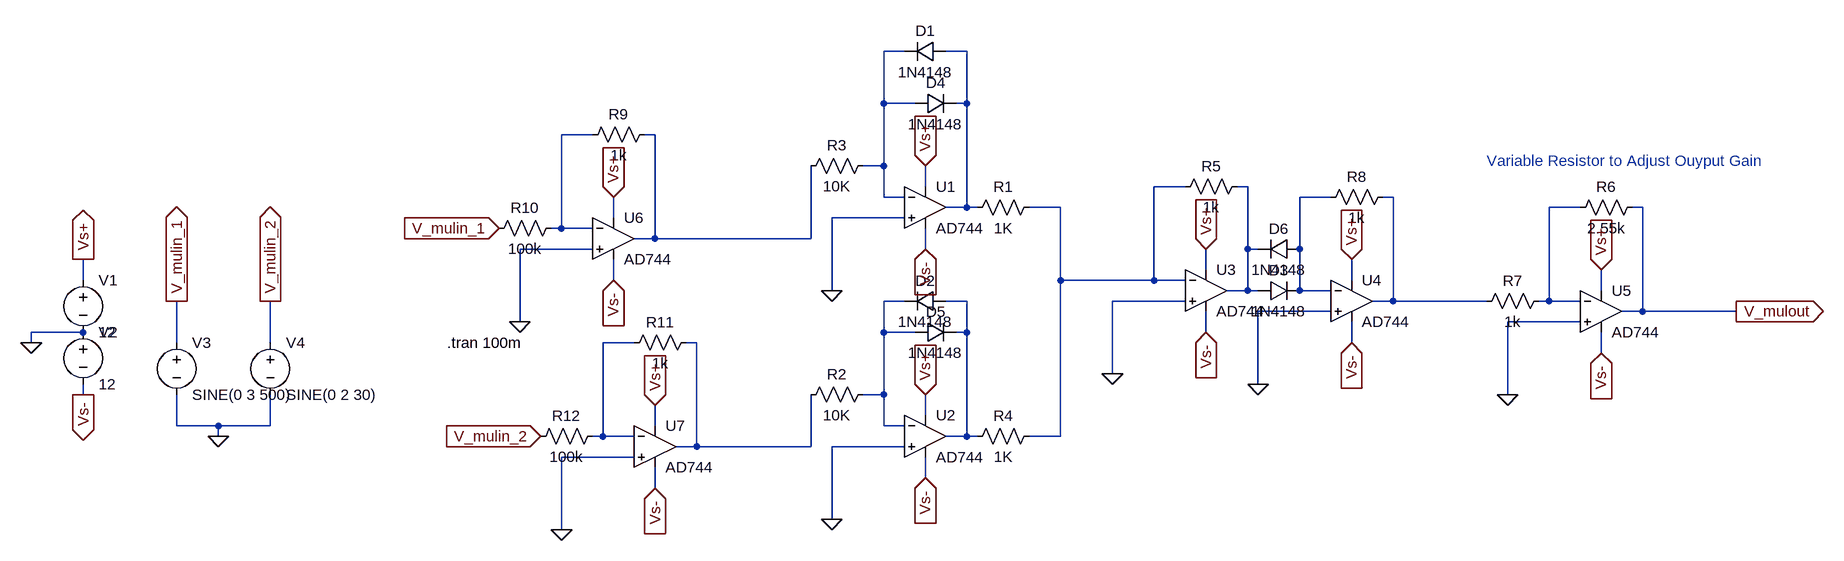
[diagram p0: schematic LogAntilog_Multiplier_FullWave.asc]
LogAntilog_Multiplier_FullWave.asc, the LTspice schematic file:
Version 4.1
SHEET 1 2556 912
WIRE 528 144 496 144
WIRE 624 144 592 144
WIRE 496 224 496 144
WIRE 544 224 496 224
WIRE 624 224 624 144
WIRE 624 224 608 224
WIRE 48 272 0 272
WIRE 144 272 128 272
WIRE 496 320 496 224
WIRE 496 320 464 320
WIRE 560 352 560 320
WIRE 960 352 912 352
WIRE 1056 352 1040 352
WIRE 496 368 496 320
WIRE 528 368 496 368
WIRE 1184 368 1136 368
WIRE 1280 368 1264 368
WIRE 624 384 624 224
WIRE 624 384 592 384
WIRE 640 384 624 384
WIRE 768 384 720 384
WIRE 1568 384 1520 384
WIRE 1664 384 1648 384
WIRE 80 400 80 368
WIRE 528 400 416 400
WIRE 0 416 0 272
WIRE 0 416 -16 416
WIRE 48 416 0 416
WIRE 144 432 144 272
WIRE 144 432 112 432
WIRE 384 432 384 320
WIRE 384 432 144 432
WIRE 48 448 -64 448
WIRE 560 448 560 416
WIRE 1056 448 1056 352
WIRE 1072 448 1056 448
WIRE 1136 448 1136 368
WIRE 992 480 992 448
WIRE -736 496 -736 464
WIRE 80 496 80 464
WIRE 768 496 768 384
WIRE 912 496 912 352
WIRE 912 496 768 496
WIRE 960 496 912 496
WIRE 1216 496 1216 464
WIRE 416 512 416 400
WIRE 1056 512 1056 448
WIRE 1056 512 1024 512
WIRE 1072 512 1056 512
WIRE 1136 512 1136 448
WIRE 1184 512 1136 512
WIRE 1600 512 1600 480
WIRE 528 528 496 528
WIRE 624 528 592 528
WIRE 960 528 848 528
WIRE 1280 528 1280 368
WIRE 1280 528 1248 528
WIRE 1424 528 1280 528
WIRE 1520 528 1520 384
WIRE 1520 528 1504 528
WIRE 1568 528 1520 528
WIRE 1184 544 1072 544
WIRE 1664 544 1664 384
WIRE 1664 544 1632 544
WIRE 1808 544 1664 544
WIRE -64 560 -64 448
WIRE 1568 560 1456 560
WIRE -736 576 -816 576
WIRE 496 576 496 528
WIRE 544 576 496 576
WIRE 624 576 624 528
WIRE 624 576 608 576
WIRE 992 576 992 544
WIRE -816 592 -816 576
WIRE -592 592 -592 528
WIRE -448 592 -448 528
WIRE 112 592 64 592
WIRE 208 592 192 592
WIRE 1216 592 1216 560
WIRE 1600 608 1600 576
WIRE 848 640 848 528
WIRE 1072 656 1072 544
WIRE -736 672 -736 656
WIRE 496 672 496 576
WIRE 496 672 464 672
WIRE 1456 672 1456 560
WIRE 560 704 560 672
WIRE -592 720 -592 672
WIRE -528 720 -592 720
WIRE -448 720 -448 672
WIRE -448 720 -528 720
WIRE 144 720 144 688
WIRE 496 720 496 672
WIRE 528 720 496 720
WIRE -528 736 -528 720
WIRE 64 736 64 592
WIRE 64 736 48 736
WIRE 112 736 64 736
WIRE 624 736 624 576
WIRE 624 736 592 736
WIRE 640 736 624 736
WIRE 768 736 768 496
WIRE 768 736 720 736
WIRE 208 752 208 592
WIRE 208 752 176 752
WIRE 384 752 384 672
WIRE 384 752 208 752
WIRE 528 752 416 752
WIRE 112 768 0 768
WIRE 560 800 560 768
WIRE 144 816 144 784
WIRE 416 864 416 752
WIRE 0 880 0 768
FLAG 560 320 Vs+
IOPIN 560 320 In
FLAG 560 448 Vs-
IOPIN 560 448 In
FLAG -816 592 0
FLAG -736 464 Vs+
IOPIN -736 464 Out
FLAG -736 672 Vs-
IOPIN -736 672 Out
FLAG -528 736 0
FLAG -448 528 V_mulin_2
IOPIN -448 528 Out
FLAG -592 528 V_mulin_1
IOPIN -592 528 Out
FLAG 416 512 0
FLAG 560 672 Vs+
IOPIN 560 672 In
FLAG 560 800 Vs-
IOPIN 560 800 In
FLAG 416 864 0
FLAG 992 448 Vs+
IOPIN 992 448 In
FLAG 992 576 Vs-
IOPIN 992 576 In
FLAG 848 640 0
FLAG 1216 464 Vs+
IOPIN 1216 464 In
FLAG 1216 592 Vs-
IOPIN 1216 592 In
FLAG 1072 656 0
FLAG -96 416 V_mulin_1
IOPIN -96 416 In
FLAG -32 736 V_mulin_2
IOPIN -32 736 In
FLAG 1600 480 Vs+
IOPIN 1600 480 In
FLAG 1600 608 Vs-
IOPIN 1600 608 In
FLAG 1456 672 0
FLAG 1808 544 V_mulout
IOPIN 1808 544 Out
FLAG 80 368 Vs+
IOPIN 80 368 In
FLAG 80 496 Vs-
IOPIN 80 496 In
FLAG -64 560 0
FLAG 144 688 Vs+
IOPIN 144 688 In
FLAG 144 816 Vs-
IOPIN 144 816 In
FLAG 0 880 0
SYMBOL OpAmps\\AD744 560 320 R0
SYMATTR InstName U1
SYMBOL res 480 304 R90
WINDOW 0 0 56 VBottom 2
WINDOW 3 32 56 VTop 2
SYMATTR InstName R3
SYMATTR Value 10K
SYMATTR SpiceLine tol=1 pwr=0.1
SYMBOL voltage -736 480 R0
WINDOW 123 0 0 Left 0
WINDOW 39 0 0 Left 0
SYMATTR InstName V1
SYMATTR Value 12
SYMBOL voltage -736 560 R0
WINDOW 123 0 0 Left 0
WINDOW 39 0 0 Left 0
SYMATTR InstName V2
SYMATTR Value 12
SYMBOL voltage -592 576 R0
WINDOW 123 0 0 Left 0
WINDOW 39 0 0 Left 0
SYMATTR InstName V3
SYMATTR Value SINE(0 3 500)
SYMBOL voltage -448 576 R0
WINDOW 123 0 0 Left 0
WINDOW 39 0 0 Left 0
SYMATTR InstName V4
SYMATTR Value SINE(0 2 30)
SYMBOL res 736 368 R90
WINDOW 0 0 56 VBottom 2
WINDOW 3 32 56 VTop 2
SYMATTR InstName R1
SYMATTR Value 1K
SYMATTR SpiceLine tol=1 pwr=0.1
SYMBOL OpAmps\\AD744 560 672 R0
SYMATTR InstName U2
SYMBOL res 480 656 R90
WINDOW 0 0 56 VBottom 2
WINDOW 3 32 56 VTop 2
SYMATTR InstName R2
SYMATTR Value 10K
SYMATTR SpiceLine tol=1 pwr=0.1
SYMBOL res 736 720 R90
WINDOW 0 0 56 VBottom 2
WINDOW 3 32 56 VTop 2
SYMATTR InstName R4
SYMATTR Value 1K
SYMATTR SpiceLine tol=1 pwr=0.1
SYMBOL OpAmps\\AD744 992 448 R0
SYMATTR InstName U3
SYMBOL res 1056 336 R90
WINDOW 0 0 56 VBottom 2
WINDOW 3 32 56 VTop 2
SYMATTR InstName R5
SYMATTR Value 1k
SYMATTR SpiceLine tol=1 pwr=0.1
SYMBOL OpAmps\\AD744 1216 464 R0
SYMATTR InstName U4
SYMBOL res 1280 352 R90
WINDOW 0 0 56 VBottom 2
WINDOW 3 32 56 VTop 2
SYMATTR InstName R8
SYMATTR Value 1k
SYMATTR SpiceLine tol=1 pwr=0.1
SYMBOL diode 1072 528 R270
WINDOW 0 32 32 VTop 2
WINDOW 3 0 32 VBottom 2
SYMATTR InstName D3
SYMATTR Value 1N4148
SYMBOL diode 544 240 R270
WINDOW 0 32 32 VTop 2
WINDOW 3 0 32 VBottom 2
SYMATTR InstName D4
SYMATTR Value 1N4148
SYMBOL diode 544 592 R270
WINDOW 0 32 32 VTop 2
WINDOW 3 0 32 VBottom 2
SYMATTR InstName D5
SYMATTR Value 1N4148
SYMBOL OpAmps\\AD744 1600 480 R0
SYMATTR InstName U5
SYMBOL res 1664 368 R90
WINDOW 0 0 56 VBottom 2
WINDOW 3 32 56 VTop 2
SYMATTR InstName R6
SYMATTR Value 2.55k
SYMATTR SpiceLine tol=1 pwr=0.1
SYMBOL res 1520 512 R90
WINDOW 0 0 56 VBottom 2
WINDOW 3 32 56 VTop 2
SYMATTR InstName R7
SYMATTR Value 1k
SYMATTR SpiceLine tol=1 pwr=0.1
SYMBOL OpAmps\\AD744 80 368 R0
SYMATTR InstName U6
SYMBOL res 144 256 R90
WINDOW 0 0 56 VBottom 2
WINDOW 3 32 56 VTop 2
SYMATTR InstName R9
SYMATTR Value 1k
SYMATTR SpiceLine tol=1 pwr=0.1
SYMBOL res 0 400 R90
WINDOW 0 0 56 VBottom 2
WINDOW 3 32 56 VTop 2
SYMATTR InstName R10
SYMATTR Value 100k
SYMATTR SpiceLine tol=1 pwr=0.1
SYMBOL OpAmps\\AD744 144 688 R0
SYMATTR InstName U7
SYMBOL res 208 576 R90
WINDOW 0 0 56 VBottom 2
WINDOW 3 32 56 VTop 2
SYMATTR InstName R11
SYMATTR Value 1k
SYMATTR SpiceLine tol=1 pwr=0.1
SYMBOL res 64 720 R90
WINDOW 0 0 56 VBottom 2
WINDOW 3 32 56 VTop 2
SYMATTR InstName R12
SYMATTR Value 100k
SYMATTR SpiceLine tol=1 pwr=0.1
SYMBOL diode 592 128 R90
WINDOW 0 0 32 VBottom 2
WINDOW 3 32 32 VTop 2
SYMATTR InstName D1
SYMATTR Value 1N4148
SYMBOL diode 592 512 R90
WINDOW 0 0 32 VBottom 2
WINDOW 3 32 32 VTop 2
SYMATTR InstName D2
SYMATTR Value 1N4148
SYMBOL diode 1136 432 R90
WINDOW 0 0 32 VBottom 2
WINDOW 3 32 32 VTop 2
SYMATTR InstName D6
SYMATTR Value 1N4148
TEXT -176 592 Left 2 !.tran 100m
TEXT 1424 312 Left 2 ;Variable Resistor to Adjust Ouyput Gain

The netlist it stands for:
* LogAntilog_Multiplier_FullWave.asc
X§U1 0 N001 Vs+ Vs- N002 AD744  ; pins In+ In- V+ V- OUT
R3 N001 N004 10K tol=1 pwr=0.1
V1 Vs+ 0 12
V2 0 Vs- 12
V3 V_mulin_1 0 SINE(0 3 500)
V4 V_mulin_2 0 SINE(0 2 30)
R1 N005 N002 1K tol=1 pwr=0.1
X§U2 0 N010 Vs+ Vs- N011 AD744  ; pins In+ In- V+ V- OUT
R2 N010 N013 10K tol=1 pwr=0.1
R4 N005 N011 1K tol=1 pwr=0.1
X§U3 0 N005 Vs+ Vs- N006 AD744  ; pins In+ In- V+ V- OUT
R5 N006 N005 1k tol=1 pwr=0.1
X§U4 0 N007 Vs+ Vs- N008 AD744  ; pins In+ In- V+ V- OUT
R8 N008 N007 1k tol=1 pwr=0.1
D3 N006 N007 1N4148
D4 N001 N002 1N4148
D5 N010 N011 1N4148
X§U5 0 N009 Vs+ Vs- V_mulout AD744  ; pins In+ In- V+ V- OUT
R6 V_mulout N009 2.55k tol=1 pwr=0.1
R7 N009 N008 1k tol=1 pwr=0.1
X§U6 0 N003 Vs+ Vs- N004 AD744  ; pins In+ In- V+ V- OUT
R9 N004 N003 1k tol=1 pwr=0.1
R10 N003 V_mulin_1 100k tol=1 pwr=0.1
X§U7 0 N012 Vs+ Vs- N013 AD744  ; pins In+ In- V+ V- OUT
R11 N013 N012 1k tol=1 pwr=0.1
R12 N012 V_mulin_2 100k tol=1 pwr=0.1
D1 N002 N001 1N4148
D2 N011 N010 1N4148
D6 N007 N006 1N4148
.model D D
.lib standard.dio
.tran 100m
* Variable Resistor to Adjust Ouyput Gain
.backanno
.end